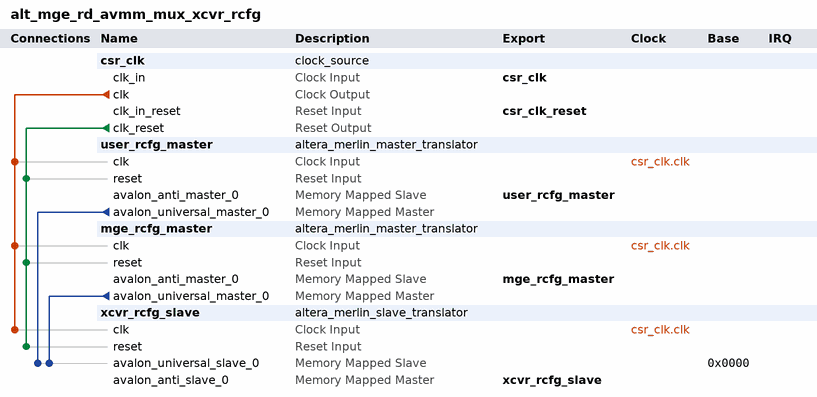
[diagram p0: system contents]
# Platform Designer (Qsys) system alt_mge_rd_avmm_mux_xcvr_rcfg, Arria 10 10AX115S4F45I3SG
# Parameters at their usual value, and those the tool derives, are not listed.
package require -exact qsys 1.0
create_system alt_mge_rd_avmm_mux_xcvr_rcfg
set_project_property DEVICE_FAMILY {Arria 10}
set_project_property DEVICE 10AX115S4F45I3SG

add_component csr_clk ip/alt_mge_rd_avmm_mux_xcvr_rcfg/alt_mge_rd_avmm_mux_xcvr_rcfg_csr_clk.ip clock_source csr_clk 0

add_component user_rcfg_master ip/alt_mge_rd_avmm_mux_xcvr_rcfg/alt_mge_rd_avmm_mux_xcvr_rcfg_user_rcfg_master.ip altera_merlin_master_translator user_rcfg_master 18.0

add_component mge_rcfg_master ip/alt_mge_rd_avmm_mux_xcvr_rcfg/alt_mge_rd_avmm_mux_xcvr_rcfg_mge_rcfg_master.ip altera_merlin_master_translator mge_rcfg_master 18.0

add_component xcvr_rcfg_slave ip/alt_mge_rd_avmm_mux_xcvr_rcfg/alt_mge_rd_avmm_mux_xcvr_rcfg_xcvr_rcfg_slave.ip altera_merlin_slave_translator xcvr_rcfg_slave 18.0

# connections
add_connection csr_clk.clk mge_rcfg_master.clk clock
add_connection csr_clk.clk user_rcfg_master.clk clock
add_connection csr_clk.clk xcvr_rcfg_slave.clk clock
add_connection csr_clk.clk_reset mge_rcfg_master.reset reset
add_connection csr_clk.clk_reset user_rcfg_master.reset reset
add_connection csr_clk.clk_reset xcvr_rcfg_slave.reset reset
add_connection mge_rcfg_master.avalon_universal_master_0 xcvr_rcfg_slave.avalon_universal_slave_0 avalon
set_connection_parameter_value mge_rcfg_master.avalon_universal_master_0/xcvr_rcfg_slave.avalon_universal_slave_0 baseAddress 0x0000
add_connection user_rcfg_master.avalon_universal_master_0 xcvr_rcfg_slave.avalon_universal_slave_0 avalon
set_connection_parameter_value user_rcfg_master.avalon_universal_master_0/xcvr_rcfg_slave.avalon_universal_slave_0 baseAddress 0x0000

# exported interfaces
add_interface csr_clk clock sink
set_interface_property csr_clk EXPORT_OF csr_clk.clk_in
add_interface csr_clk_reset reset sink
set_interface_property csr_clk_reset EXPORT_OF csr_clk.clk_in_reset
add_interface mge_rcfg_master avalon slave
set_interface_property mge_rcfg_master EXPORT_OF mge_rcfg_master.avalon_anti_master_0
add_interface user_rcfg_master avalon slave
set_interface_property user_rcfg_master EXPORT_OF user_rcfg_master.avalon_anti_master_0
add_interface xcvr_rcfg_slave avalon master
set_interface_property xcvr_rcfg_slave EXPORT_OF xcvr_rcfg_slave.avalon_anti_slave_0

set_interconnect_requirement {$system} qsys_mm.clockCrossingAdapter HANDSHAKE
set_interconnect_requirement {$system} qsys_mm.maxAdditionalLatency 1

save_system alt_mge_rd_avmm_mux_xcvr_rcfg.qsys
